# EAGLE design TLI5012B_E1000_2Go_Kit (EAGLE 9.5.2)

## Sheet 1 of 2
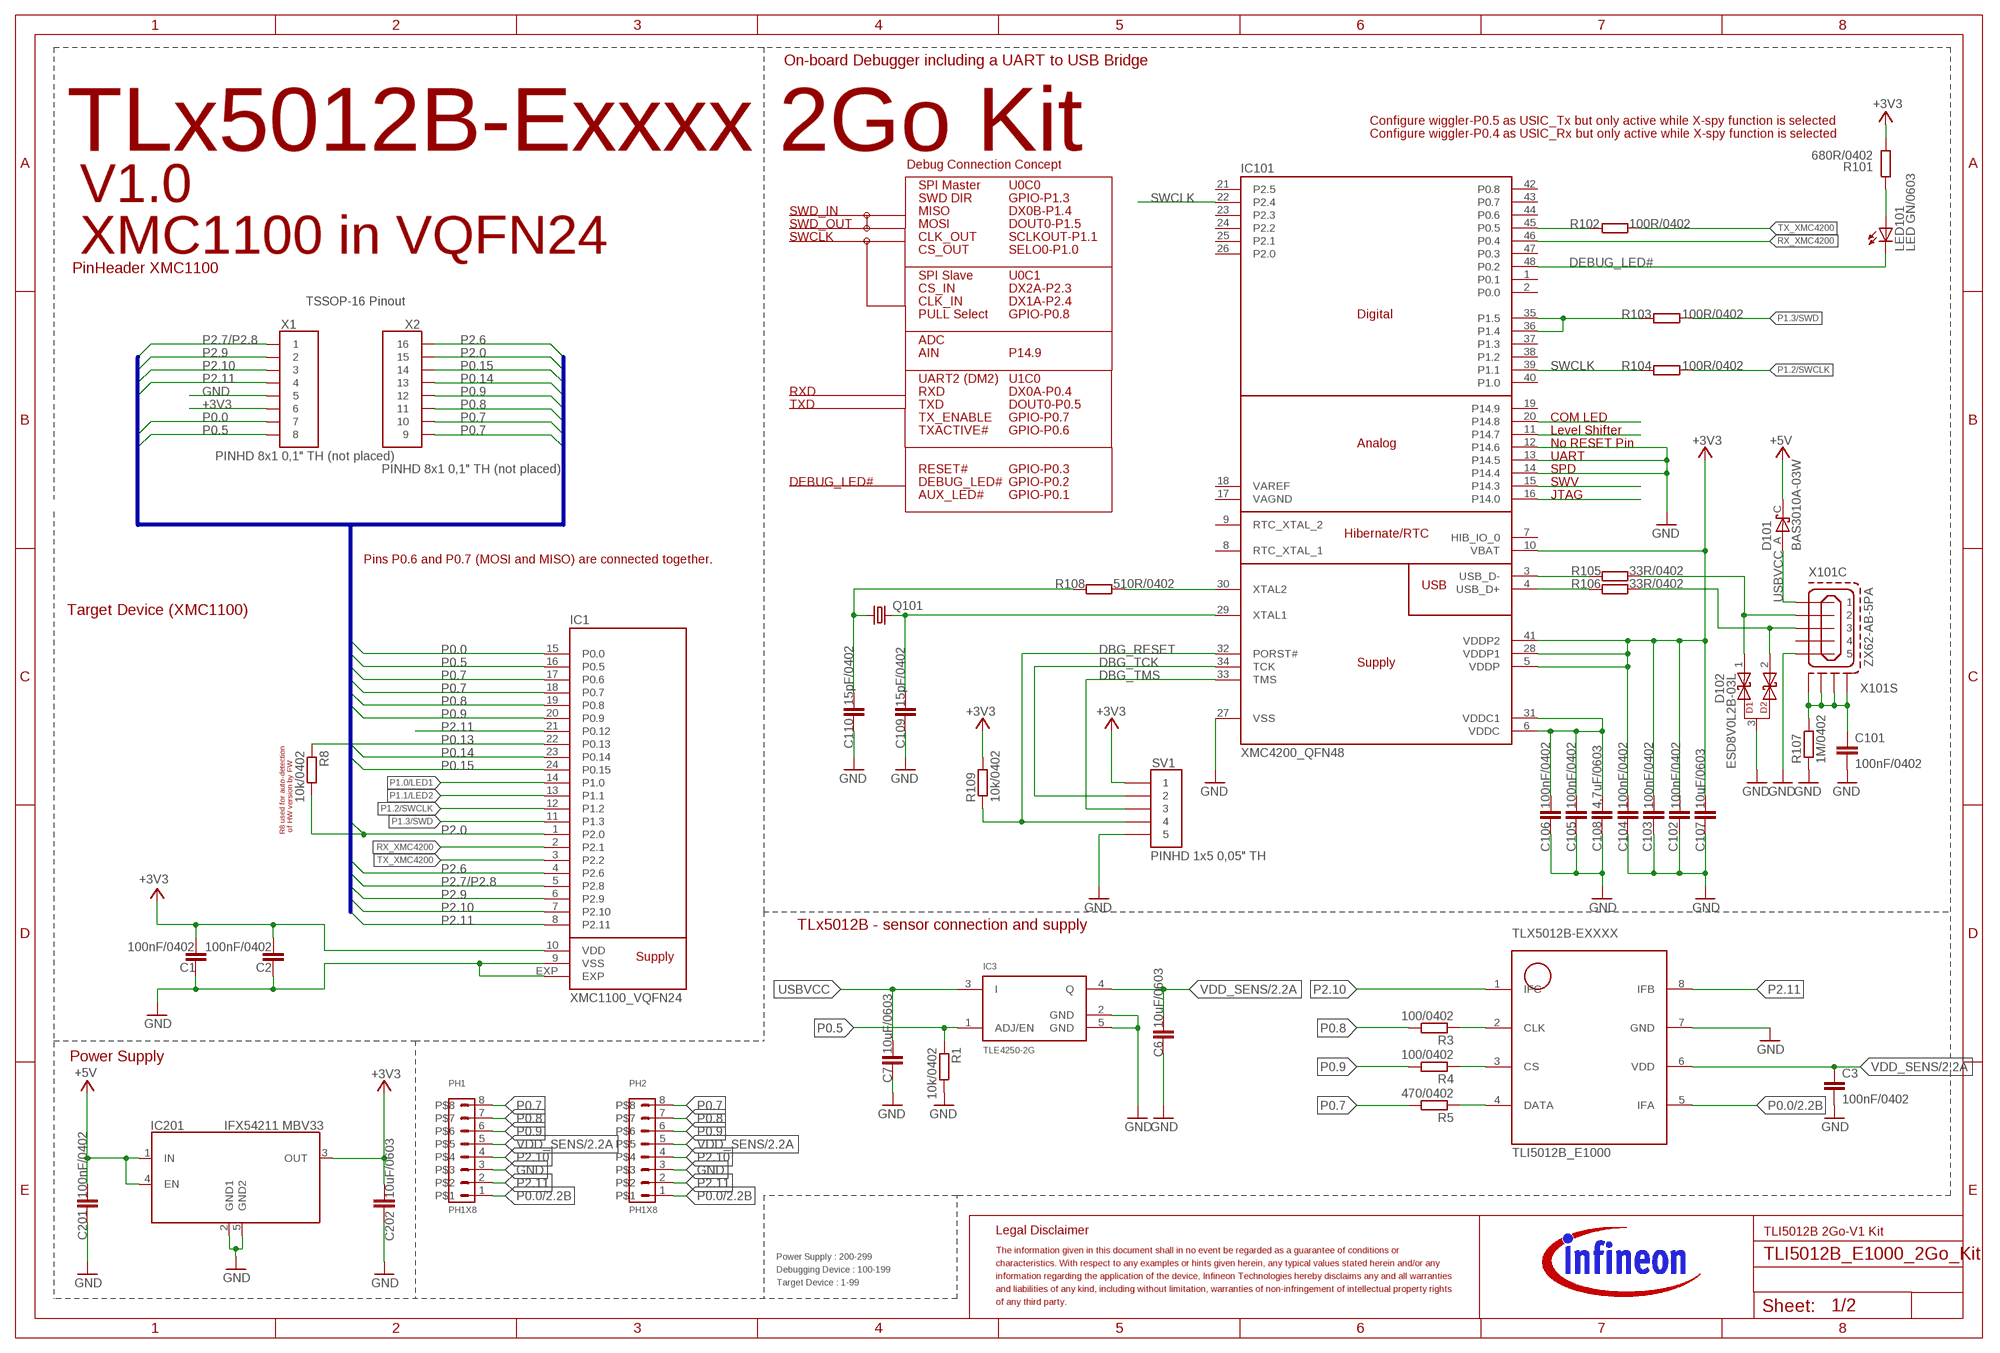
[diagram p0: schematic, sheet 1]

### Parts
C1  100nF/0402  C-EUC0402  [C0402]
C2  100nF/0402  C-EUC0402  [C0402]
C3  100nF/0402  C-EUC0402  [C0402]
C6  10uF/0603  C-EUC0603  [C0603]
C7  10uF/0603  C-EUC0603  [C0603]
C101  100nF/0402  C-EUC0402  [C0402]
C102  100nF/0402  C-EUC0402  [C0402]
C103  100nF/0402  C-EUC0402  [C0402]
C104  100nF/0402  C-EUC0402  [C0402]
C105  100nF/0402  C-EUC0402  [C0402]
C106  100nF/0402  C-EUC0402  [C0402]
C107  10uF/0603  C-EUC0603  [C0603]
C108  4,7uF/0603  C-EUC0603  [C0603]
C109  15pF/0402  C-EUC0402  [C0402]
C110  15pF/0402  C-EUC0402  [C0402]
C201  100nF/0402  C-EUC0402  [C0402]
C202  10uF/0603  C-EUC0603  [C0603]
D101  BAS3010A-03W  BAT60  [SOD323-R]
D102  ESD8V0L2B-03L  [TSLP-3-1]
IC1  XMC1100_VQFN24  [VQFN24]
IC3  TLE4250-2G  [PG-SCT595]
IC101  XMC4200_QFN48  [QFN-48-7X7]
IC201  IFX54211 MBV33  TLS202B1MBV  [SCT595_INFINEON]
LED101  LED GN/0603  LEDCHIPLED_0603  [CHIPLED_0603]
PH1  PH1X8  [PH005-1-8]
PH2  PH1X8  [PH005-1-8]
Q101  NX3225_2  [32X25_4PAD]
R1  10k/0402  R-EU_R0402  [R0402]
R3  100/0402  R-EU_R0402  [R0402]
R4  100/0402  R-EU_R0402  [R0402]
R5  470/0402  R-EU_R0402  [R0402]
R8  10k/0402  R-EU_R0402  [R0402]
R101  680R/0402  R-EU_R0402  [R0402]
R102  100R/0402  R-EU_R0402  [R0402]
R103  100R/0402  R-EU_R0402  [R0402]
R104  100R/0402  R-EU_R0402  [R0402]
R105  33R/0402  R-EU_R0402  [R0402]
R106  33R/0402  R-EU_R0402  [R0402]
R107  1M/0402  R-EU_R06030402  [R0402]
R108  510R/0402  R-EU_R0402  [R0402]
R109  10k/0402  R-EU_R0402  [R0402]
SV1  PINHD 1x5 0,05" TH  PINHEAD_127  [PINHEAD_127]
TLX5012B-EXXXX  TLI5012B_E1000  [INF-PG-DSO-8-16]
X1  PINHD 8x1 0,1" TH (not placed)  PINHD_1X8_SP  [PINHD_1X8_SP]
X2  PINHD 8x1 0,1" TH (not placed)  PINHD_1X8_SP  [PINHD_1X8_SP]
X101  ZX62-AB-5PA  ZX62-AB-5PA_MICRO-USB  [ZX62-AB-5PA_MICRO-USB]

### Nets
+3V3: C1.2 C2.2 C102.1 C103.1 C104.1 C107.1 C202.1 IC1.10(VDD) IC101.5(VDDP) IC101.10(VBAT) IC101.28(VDDP1) IC101.41(VDDP2) IC201.3(OUT) R101.1 R109.2 SV1.P$1 X1.6
+5V: C201.1 D101.C IC201.1(IN) IC201.4(EN)
DBG_RESET: IC101.32(PORST#) R109.1 SV1.P$4
DBG_TCK: IC101.34(TCK) SV1.P$2
DBG_TMS: IC101.33(TMS) SV1.P$3
DEBUG_LED#: IC101.48(P0.2) LED101.C
GND: C1.1 C2.1 C3.2 C6.2 C7.2 C101.2 C102.2 C103.2 C104.2 C105.2 C106.2 C107.2 C108.2 C109.2 C110.2 C201.2 C202.2 D102.3 IC1.9(VSS) IC1.EXP IC3.2(GND) IC3.5(GND) IC101.12(P14.6) IC101.13(P14.5) IC101.14(P14.4) IC101.27(VSS) IC201.2(GND1) IC201.5(GND2) PH1.3 PH2.3 R1.2 R107.1 SV1.P$5 TLX5012B-EXXXX.7(GND) X1.5 X101.5 ; also sheet 2
N$2: IC101.35(P1.5) IC101.36(P1.4) R103.1
N$4: R3.1 TLX5012B-EXXXX.2(CLK)
N$5: R4.1 TLX5012B-EXXXX.3(CS)
N$6: IC101.45(P0.5) R102.1
N$7: IC101.20(P14.8)
N$8: IC101.11(P14.7)
N$9: R5.1 TLX5012B-EXXXX.4(DATA)
N$20: IC101.16(P14.0)
N$21: IC101.15(P14.3)
N$23: C101.1 R107.2 X101.S1(S:S1) X101.S2(S:S2) X101.S3(S:S3) X101.S4(S:S4)
N$36: LED101.A R101.2
N$40: D102.1 R105.2 X101.2
N$41: D102.2 R106.2 X101.3
N$42: IC101.30(XTAL2) R108.2
N$43: C110.1 Q101.1 R108.1
P0.0: IC1.15(P0.0) PH1.1 PH2.1 TLX5012B-EXXXX.5(IFA) X1.7 ; also sheet 2
P0.5: IC1.16(P0.5) IC3.1(ADJ/EN) R1.1 X1.8
P0.7: IC1.17(P0.6) IC1.18(P0.7) PH1.8 PH2.8 R5.2 X2.7 X2.8
P0.8: IC1.19(P0.8) PH1.7 PH2.7 R3.2 X2.6
P0.9: IC1.20(P0.9) PH1.6 PH2.6 R4.2 X2.5
P0.13: IC1.22(P0.13) R8.1
P0.14: IC1.23(P0.14) X2.4 ; also sheet 2
P0.15: IC1.24(P0.15) X2.3 ; also sheet 2
P1.0/LED1: IC1.14(P1.0)
P1.1/LED2: IC1.13(P1.1)
P1.2/SWCLK: IC1.12(P1.2) R104.2
P1.3/SWD: IC1.11(P1.3) R103.2
P2.0: IC1.1(P2.0) R8.2 X2.2
P2.6: IC1.4(P2.6) X2.1
P2.7/P2.8: IC1.5(P2.8) X1.P$1
P2.9: IC1.6(P2.9) X1.2
P2.10: IC1.7(P2.10) PH1.4 PH2.4 TLX5012B-EXXXX.1(IFC) X1.3
P2.11: IC1.8(P2.11) IC1.21(P0.12) PH1.2 PH2.2 TLX5012B-EXXXX.8(IFB) X1.4
Q200: C109.1 IC101.29(XTAL1) Q101.3
RX_XMC4200: IC1.2(P2.1) IC101.46(P0.4)
SWCLK: IC101.22(P2.4) IC101.39(P1.1) R104.1
TX_XMC4200: IC1.3(P2.2) R102.2
USBVCC [usbvcc]: C7.1 D101.A IC3.3(I) X101.1
VDD_SENS: C3.1 C6.1 IC3.4(Q) PH1.5 PH2.5 TLX5012B-EXXXX.6(VDD) ; also sheet 2
WUSB_DM: IC101.3(USB_D-) R105.1
WUSB_DP: IC101.4(USB_D+) R106.1
WVDDC: C105.1 C106.1 C108.1 IC101.6(VDDC) IC101.31(VDDC1)
Unconnected: IC101.1(P0.1) IC101.2(P0.0) IC101.7(HIB_IO_0) IC101.8(RTC_XTAL_1) IC101.9(RTC_XTAL_2) IC101.17(VAGND) IC101.18(VAREF) IC101.19(P14.9) IC101.21(P2.5) IC101.23(P2.3) IC101.24(P2.2) IC101.25(P2.1) IC101.26(P2.0) IC101.37(P1.3) IC101.38(P1.2) IC101.40(P1.0) IC101.42(P0.8) IC101.43(P0.7) IC101.44(P0.6) IC101.47(P0.3) X101.4

### Buses
P2.6,P2.0,P0.15,P0.14,P0.9,P0.8,P0.7,P0.6,P0.5,P0.0,P2.11,P2.10,P2.9,P2.7/P2.8

### Notes on the sheet
- On-board Debugger including a UART to USB Bridge
- Configure wiggler-P0.5 as USIC_Tx but only active while X-spy function is selected
- Configure wiggler-P0.4 as USIC_Rx but only active while X-spy function is selected
- TLx5012B-Exxxx 2Go Kit
- Debug Connection Concept
- SPI Master | U0C0
- V1.0 | SWD DIR | GPIO-P1.3
- SWD_IN | MISO | DX0B-P1.4
- SWD_OUT | MOSI | DOUT0-P1.5
- SWCLK | CLK_OUT | SCLKOUT-P1.1
- XMC1100 in VQFN24 | CS_OUT | SELO0-P1.0
- PinHeader XMC1100
- SPI Slave | U0C1
- CS_IN | DX2A-P2.3
- TSSOP-16 Pinout | CLK_IN | DX1A-P2.4
- PULL Select | GPIO-P0.8
- ADC
- 1 | 16
- AIN | P14.9
- 2 | 15
- 3 | 14
- UART2 (DM2) | U1C0
- 4 | 13
- RXD | RXD | DX0A-P0.4
- 5 | 12
- TXD | TXD | DOUT0-P0.5
- 6 | 11
- TX_ENABLE | GPIO-P0.7 | COM LED
- 7 | 10
- TXACTIVE# | GPIO-P0.6 | Level Shifter
- 8 | 9
- No RESET Pin
- UART
- RESET# | GPIO-P0.3 | SPD
- DEBUG_LED# | DEBUG_LED# | GPIO-P0.2 | SWV
- AUX_LED# | GPIO-P0.1 | JTAG
- Pins P0.6 and P0.7 (MOSI and MISO) are connected together.
- Target Device (XMC1100)
- R8 used for auto-detection
   of HW version by FW
- TLx5012B - sensor connection and supply
- Power Supply
- TLI5012B 2Go-V1 Kit
- Power Supply : 200-299
- Debugging Device : 100-199
- Target Device : 1-99

## Sheet 2 of 2
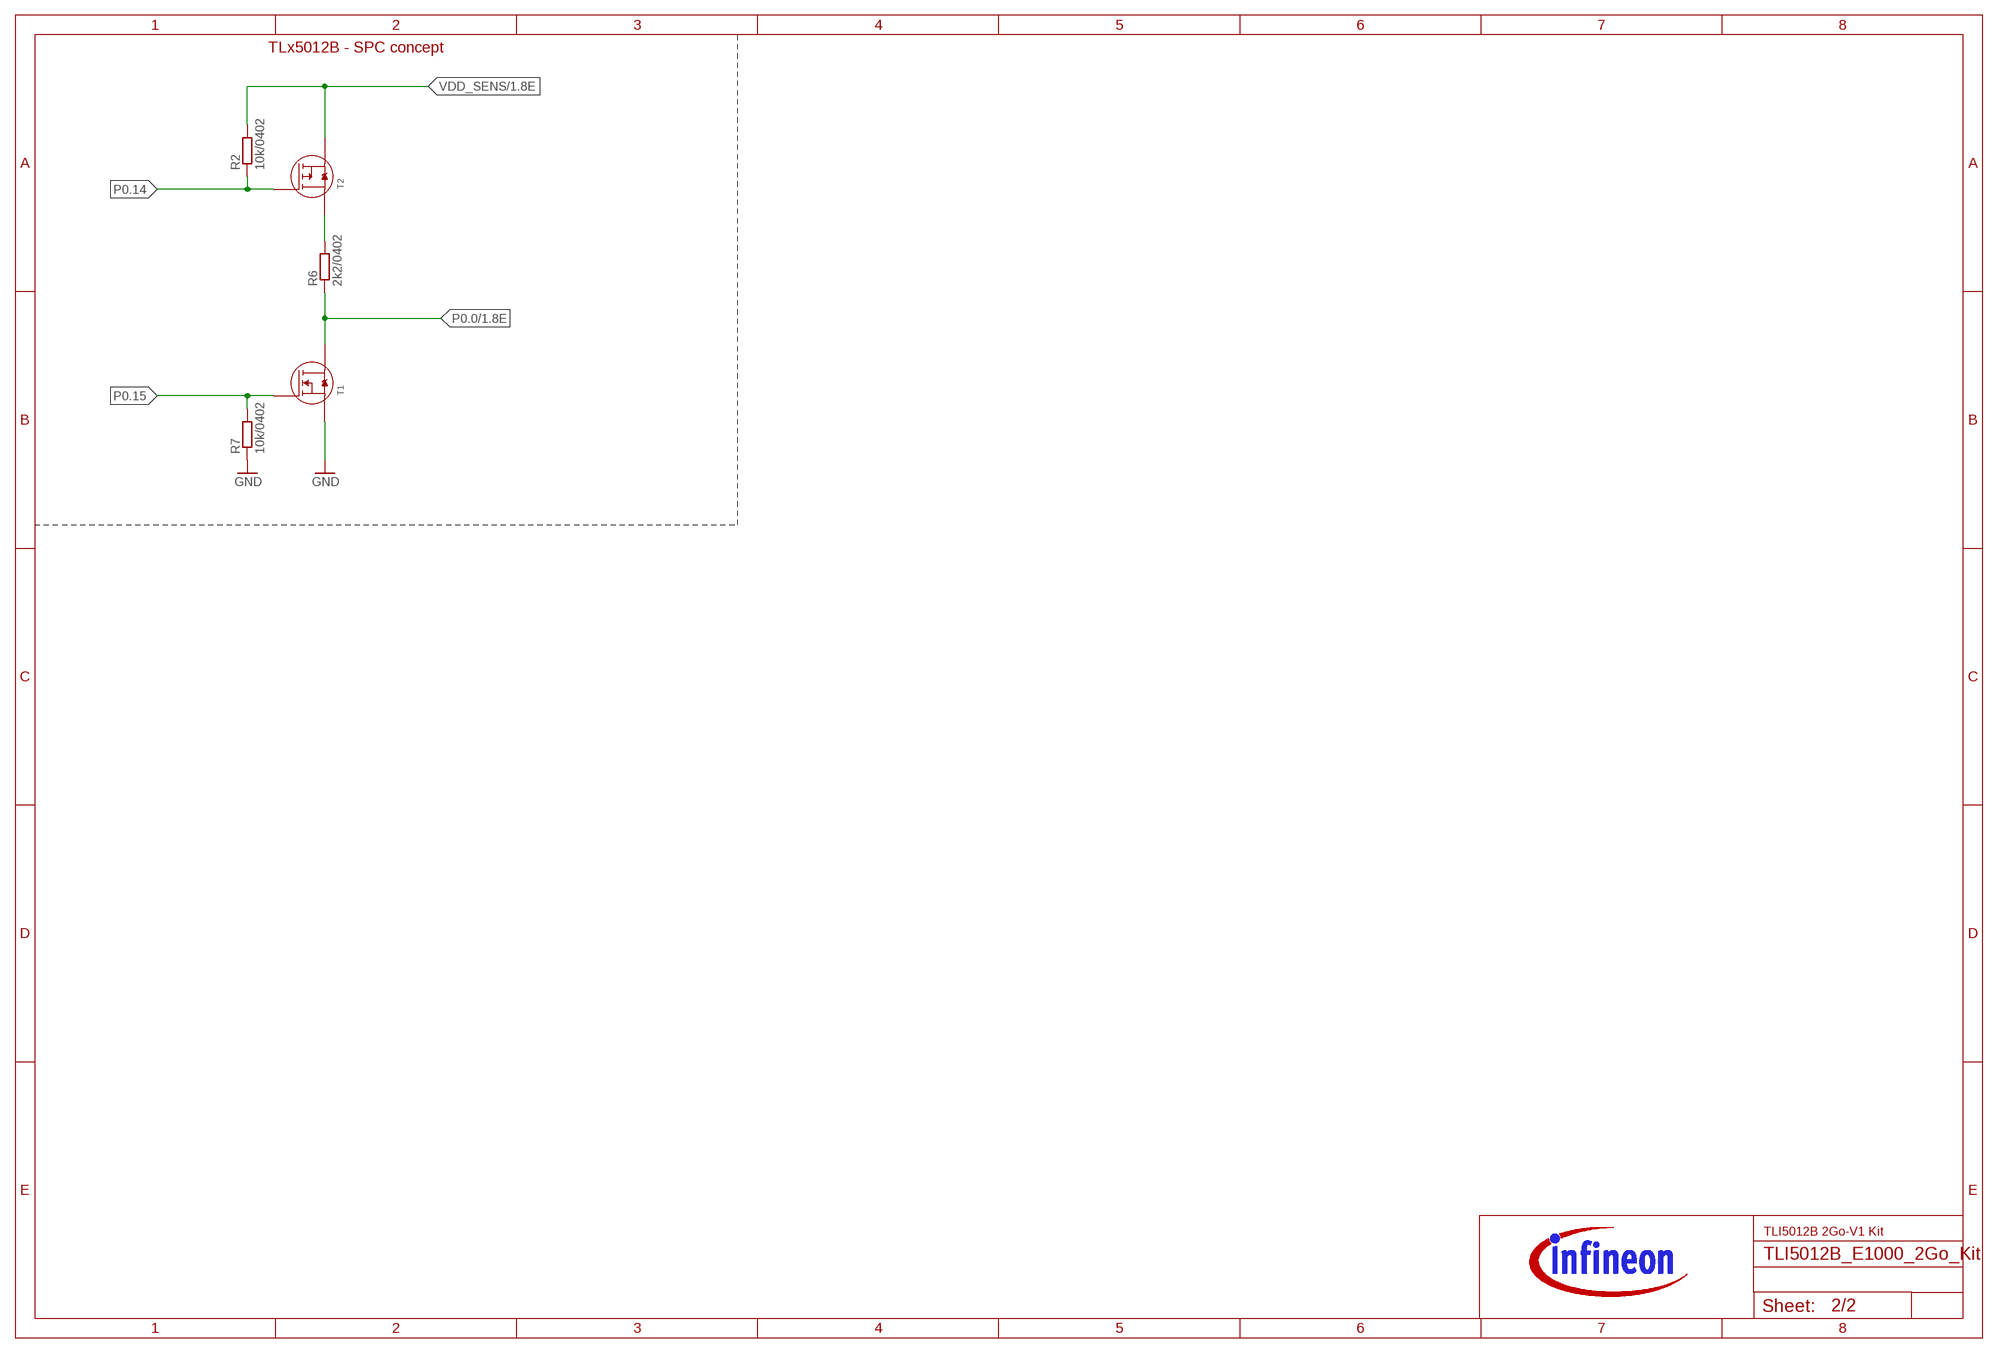
[diagram p1: schematic, sheet 2]

### Parts
R2  10k/0402  R-EU_R0402  [R0402]
R6  2k2/0402  R-EU_R0402  [R0402]
R7  10k/0402  R-EU_R0402  [R0402]
T1  BSS138N  [INF-PG-SOT23_N_1PRIMARY]
T2  BSS84P  [INF-PG-SOT23_N_1PRIMARY]

### Nets
GND: R7.1 T1.2(S) ; also sheet 1
N$1: R6.2 T2.3(D)
P0.0: R6.1 T1.3(D) ; also sheet 1
P0.14: R2.1 T2.1(G) ; also sheet 1
P0.15: R7.2 T1.1(G) ; also sheet 1
VDD_SENS: R2.2 T2.2(S) ; also sheet 1

### Notes on the sheet
- TLx5012B - SPC concept
- TLI5012B 2Go-V1 Kit

## Library data of the parts
C1-C3 C101-C106 C109 C110 C201 = DsC:C-EUC0402
C6 C7 C107 C108 C202 = rcl:C-EU: CAPACITOR, European symbol
D101 = DsDiod:BAT60
D102 = DsDiod:ESD8V0L2B-03L
IC1 = XMC1100:XMC1100_VQFN24
IC3 = TLE4250-2G:TLE4250-2G: TLE4250-2G Low Dropout Voltage Tracking Regulator PG-SCT595
IC101 = XMC4000_v4.16:XMC4200_QFN48
IC201 = TLS202B1:TLS202B1MBV
LED101 = led:LED: LED OSRAM: - CHIPLED LG R971, LG N971, LY N971, LG Q971, LY Q971, LO R971, LY R971 LH N974, LH R974 LS Q976, LO Q976, LY Q976 LO Q996 - Hyper CHIPLED LW Q18S LB Q993, LB Q99A, LB R99A - SideLED LS A670, LO A670, LY A670, LG A670, LP A670 LB A673, LV A673, LT A673, LW A673 LH A674 LY A675 LS A676, LA A676, LO A676, LY A676, LW A676 LS A679, LY A679, LG A679 - Hyper Micro SIDELED® LS Y876, LA Y876, LO Y876, LY Y876 LT Y87S - SmartLED LW L88C, LW L88S LB L89C, LB L89S, LG L890 LS L89K, LO L89K, LY L89K LS L896, LA L896, LO L896, LY L896 - TOPLED LS T670, LO T670, LY T670, LG T670, LP T670 LSG T670, LSP T670, LSY T670, LOP T670, LYG T670 LG T671, LOG T671, LSG T671 LB T673, LV T673, LT T673, LW T673 LH T674 LS T676, LA T676, LO T676, LY T676, LB T676, LH T676, LSB T676, LW T676 LB T67C, LV T67C, LT T67C, LS T67K, LO T67K, LY T67K, LW E67C LS E67B, LA E67B, LO E67B, LY E67B, LB E67C, LV E67C, LT E67C LW T67C LS T679, LY T679, LG T679 LS T770, LO T770, LY T770, LG T770, LP T770 LB T773, LV T773, LT T773, LW T773 LH T774 LS E675, LA E675, LY E675, LS T675 LS T776, LA T776, LO T776, LY T776, LB T776 LHGB T686 LT T68C, LB T68C - Hyper Mini TOPLED® LB M676 - Mini TOPLED Santana® LG M470 LS M47K, LO M47K, LY M47K Source: http://www.osram.convergy.de LUXEON: - LUMILED® LXK2-PW12-R00, LXK2-PW12-S00, LXK2-PW14-U00, LXK2-PW14-V00 LXK2-PM12-R00, LXK2-PM12-S00, LXK2-PM14-U00 LXK2-PE12-Q00, LXK2-PE12-R00, LXK2-PE12-S00, LXK2-PE14-T00, LXK2-PE14-U00 LXK2-PB12-K00, LXK2-PB12-L00, LXK2-PB12-M00, LXK2-PB14-N00, LXK2-PB14-P00, LXK2-PB14-Q00 LXK2-PR12-L00, LXK2-PR12-M00, LXK2-PR14-Q00, LXK2-PR14-R00 LXK2-PD12-Q00, LXK2-PD12-R00, LXK2-PD12-S00 LXK2-PH12-R00, LXK2-PH12-S00 LXK2-PL12-P00, LXK2-PL12-Q00, LXK2-PL12-R00 Source: www.luxeon.com KINGBRIGHT: KA-3528ASYC Source: www.kingbright.com
PH1 PH2 = nonstandardpinhead:PH1X8
Q101 = Quarz:NX3225_2
R1-R8 R101-R106 R108 R109 = DsR:R-EU_R0402
R107 = DsR:R-EU_R0603
SV1 = pinhead_127_marked:PINHEAD_127
T1 = INF-PG-SOT23_N:BSS138N
T2 = INF-PG-SOT23_N:BSS84P
TLX5012B-EXXXX = TLI5012B_E1000:TLI5012B_E1000
X1 = Pinhead_1x8_sp_V2:PINHD_1X8_SP
X2 = Pinhead_1x8_sp:PINHD_1X8_SP
X101 = XSRRND:ZX62-AB-5PA_MICRO-USB

## Net classes
0 default: width 0.178 mm, drill 0.127 mm, clearance 0.2 mm
1 power: width 0.61 mm, drill 0.127 mm, clearance 0.152 mm
2 gnd: width 0.305 mm, drill 0.127 mm, clearance 0.152 mm
3 usbvcc: width 0.508 mm, drill 0.127 mm, clearance 0.152 mm
4 aref: width 0.406 mm

## Board
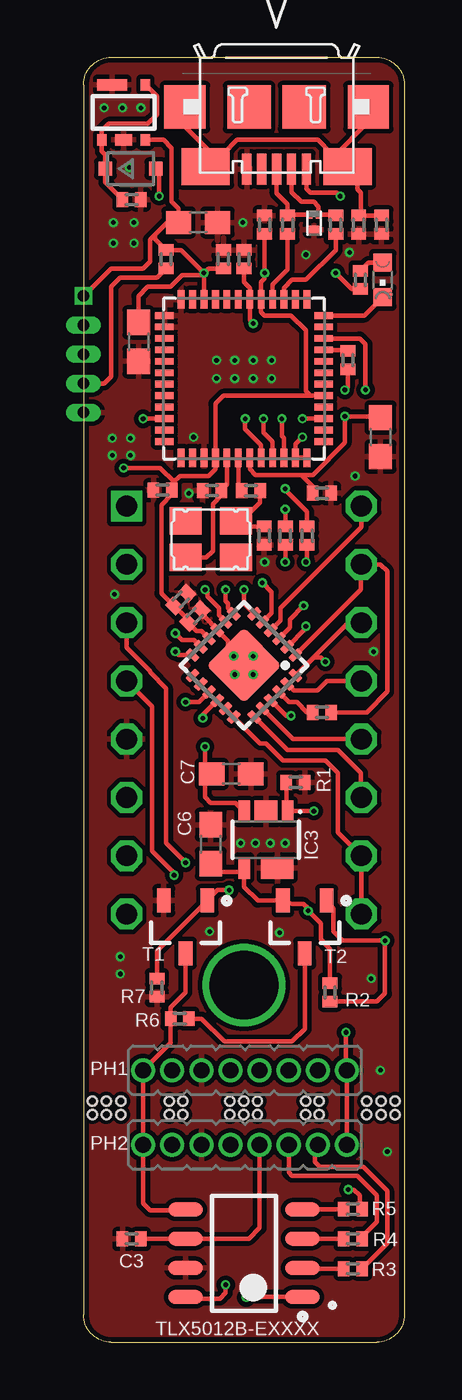
[diagram p2: board, top side]
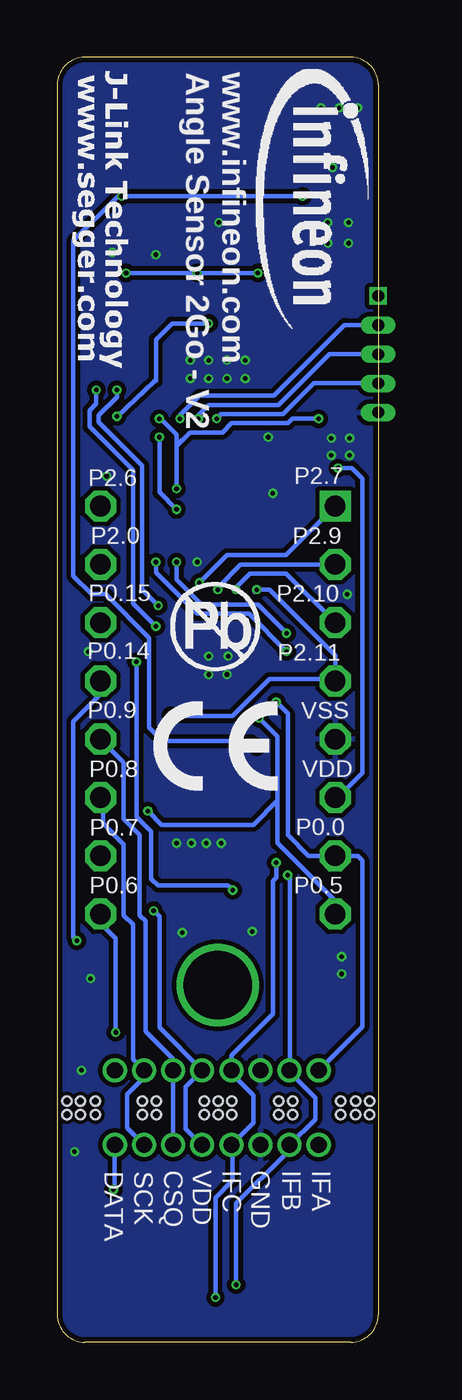
[diagram p3: board, bottom side, seen from below]

Size 14 x 56 mm. Coordinates in mm from the lower left corner, seen from the top.
Outline: 0,54.8 arc-90 1.2,56 12.8,56 arc-90 14,54.8 14,1.2 arc-90 12.8,0 1.2,0 arc-90 0,1.2 0,54.8
Copper layers (1*16): Top 0.018mm / dielectric 1.55mm / Bottom 0.018mm
Design rules "Multi-CB_2L_100um-Tracks_OL35um *": minimum track width 0.1mm, minimum drill 0.1mm, track to track 0.1mm, track to pad 0.1mm, pad to pad 0.1mm, via to via 0.1mm, smd to smd 0mil, copper to edge 0.2mm, drill to drill 0.2mm, minimum pad ring 0.1mm, minimum via ring 0.1mm, stop-mask expansion 2mil, vias tented up to drill 0.45mm, thermal gap 0.2mm
Holes 0.4 mm at 6.99,10.51 7.59,10.51 7.59,9.91 6.99,9.91 9.69,10.51 9.69,9.91 10.29,9.91 10.29,10.51 12.99,10.51 13.59,10.51 12.99,9.91 13.59,9.91 4.34,10.51 0.99,10.51 0.39,10.51 4.34,9.91 0.99,9.91 0.39,9.91 6.39,10.51 6.39,9.91 1.64,10.51 1.64,9.91 3.74,10.51 3.74,9.91 12.34,10.51 12.34,9.91
tRestrict: 4 lines

### Footprints (pad centres in the part's own frame; a part is rotated, then mirrored left to right if it is on the bottom)
C0402 = smd 0.5 x 0.65: 1 -0.4,0; 2 0.4,0
C0603 = smd 1.1 x 1: 1 -0.85,0; 2 0.85,0
SOD323-R = smd 0.6 x 0.6: A 1.1,0; C -1.1,0
TSLP-3-1 = smd 0.225 x 0.35: 1 0.113,-0.475; 2 0.487,-0.475 | smd 0.6 x 0.35: 3 0.3,0.175
VQFN24 = smd 0.6 x 0.3: 1 -1.905,1.27; 2 -1.905,0.762; 3 -1.905,0.254; 4 -1.905,-0.254; 5 -1.905,-0.762; 6 -1.905,-1.27; 13 1.905,-1.27; 14 1.905,-0.762; 15 1.905,-0.254; 16 1.905,0.254; 17 1.905,0.762; 18 1.905,1.27 | smd 0.3 x 0.6: 7 -1.27,-1.905; 8 -0.762,-1.905; 9 -0.254,-1.905; 10 0.254,-1.905; 11 0.762,-1.905; 12 1.27,-1.905; 19 1.27,1.905; 20 0.762,1.905; 21 0.254,1.905; 22 -0.254,1.905; 23 -0.762,1.905; 24 -1.27,1.905 | smd 2.35 x 2.35: EXP 0,0
PG-SCT595 = smd 0.95 x 0.5: 1 -1.225,0.95; 3 -1.225,-0.95; 4 1.225,-0.95 | smd 0.95 x 1: 2 -1.225,0 | smd 0.95 x 1.4: 5 1.225,0.5
QFN-48-7X7 = smd 0.8 x 0.3: 1 -3.45,2.75; 2 -3.45,2.25; 3 -3.45,1.75; 4 -3.45,1.25; 5 -3.45,0.75; 6 -3.45,0.25; 7 -3.45,-0.25; 8 -3.45,-0.75; 9 -3.45,-1.25; 10 -3.45,-1.75; 11 -3.45,-2.25; 12 -3.45,-2.75; 25 3.45,-2.75; 26 3.45,-2.25; 27 3.45,-1.75; 28 3.45,-1.25; 29 3.45,-0.75; 30 3.45,-0.25; 31 3.45,0.25; 32 3.45,0.75; 33 3.45,1.25; 34 3.45,1.75; 35 3.45,2.25; 36 3.45,2.75 | smd 0.3 x 0.8: 13 -2.75,-3.475; 14 -2.25,-3.475; 15 -1.75,-3.475; 16 -1.25,-3.475; 17 -0.75,-3.475; 18 -0.25,-3.475; 19 0.25,-3.475; 20 0.75,-3.475; 21 1.25,-3.475; 22 1.75,-3.475; 23 2.25,-3.475; 24 2.75,-3.475; 37 2.75,3.475; 38 2.25,3.475; 39 1.75,3.475; 40 1.25,3.475; 41 0.75,3.475; 42 0.25,3.475; 43 -0.25,3.475; 44 -0.75,3.475; 45 -1.25,3.475; 46 -1.75,3.475; 47 -2.25,3.475; 48 -2.75,3.475
SCT595_INFINEON = smd 0.4 x 0.5: 1 -0.95,-1.2; 3 0.95,-1.2; 4 0.95,1.2 | smd 0.75 x 0.5: 2 0,-1.2 | smd 1.3 x 0.5: 5 -0.5,1.2
CHIPLED_0603 = smd 0.8 x 0.8: A 0,-0.75; C 0,0.75
PH005-1-8 = drill 0.7 pad 1.016: 1 0,0; 2 1.27,0; 3 2.54,0; 4 3.81,0; 5 5.08,0; 6 6.35,0; 7 7.62,0; 8 8.89,0
32X25_4PAD = smd 1.4 x 1.2: 1 -1.1,-0.8; 2 1.1,-0.8; 3 1.1,0.8; 4 -1.1,0.8
R0402 = smd 0.5 x 0.65: 1 -0.4,0; 2 0.4,0
PINHEAD_127 = drill 0.508 square: P$1 0,0 | drill 0.508 long: P$2 0,-1.27; P$3 0,-2.54; P$4 0,-3.81; P$5 0,-5.08
INF-PG-SOT23_N_1PRIMARY = smd 1.05 x 0.6: 1 -1.15,0.95; 2 -1.15,-0.95; 3 1.15,0
INF-PG-DSO-8-16 = smd 1.5 x 0.6: 1 -2.55,1.905; 2 -2.55,0.635; 3 -2.55,-0.635; 4 -2.55,-1.905; 5 2.55,-1.905; 6 2.55,-0.635; 7 2.55,0.635; 8 2.55,1.905
PINHD_1X8_SP = drill 0.9 octagon: 2 0,7.62; 3 0,5.08; 4 0,2.54; 5 0,0; 6 0,-2.54; 7 0,-5.08; 8 0,-7.62 | drill 0.9 square: P$1 0,10.16
PINHD_1X8_SP' = drill 0.9 octagon: 1 0,10.16; 2 0,7.62; 3 0,5.08; 4 0,2.54; 5 0,0; 6 0,-2.54; 7 0,-5.08; 8 0,-7.62
ZX62-AB-5PA_MICRO-USB = smd 0.4 x 1.35: 1 -1.3,1.45; 2 -0.65,1.45; 3 0,1.45; 4 0.65,1.45; 5 1.3,1.45 | smd 2.1 x 1.6: S1 -3.1,1.35; S2 3.1,1.35 | smd 1.8 x 1.9: S3 -4,-1.25; S4 4,-1.25 | smd 1.9 x 1.9: S5 -1.2,-1.25; S6 1.2,-1.25

### Placement (x,y rotation side)
C1  4.85,31.65 225 top
C2  4.24,32.37 225 top
C3  2.1,4.5 180 top
C6  5.55,21.7 90 top
C7  6.45,24.77 0 top
C101  13,48.7 270 top
C102  3.45,37.14 180 top
C103  6.1,47.2 90 top
C104  7.9,48.7 90 top
C105  10.4,37 0 top
C106  7,47.2 90 top
C107  2.4,43.6 270 top
C108  12.95,39.45 270 top
C109  5.6,37.12 180 top
C110  7.88,35.15 270 top
C201  2.1,49.8 0 top
C202  5,48.8 0 top
D101  2.05,51.15 0 top
D102  10.36,48.67 180 top
IC1  7,29.5 225 top
IC3  7.95,21.9 270 top
IC101  7,42 270 top
IC201  1.75,53.6 0 top
LED101  13.05,46.3 180 top
PH1  2.6,11.85 0 top
PH2  2.6,8.6 0 top
Q101  5.55,35 180 top
R1  9.25,24.4 0 top
R2  10.75,15.25 90 top
R3  11.75,3.2 0 top
R4  11.75,4.5 0 top
R5  11.75,5.8 0 top
R6  4.2,14.1 0 top
R7  3.2,15.45 90 top
R8  10.4,27.45 0 top
R101  12.08,46.3 90 top
R102  11.53,42.8 270 top
R103  8.8,35.15 270 top
R104  9.75,35.15 270 top
R105  11,48.7 90 top
R106  8.9,48.7 90 top
R107  12,48.7 90 top
R108  7.3,37.11 180 top
R109  3.6,47.2 90 top
SV1  0,45.6 0 top
T1  4.45,18.1 270 top
T2  9.65,18.1 270 top
TLX5012B-EXXXX  7,3.88 180 top
U$2  [INFINEON_LOGO_INFINEON_LOGO_5_SILK]  5.74,55.89 270 bottom
U$3  [CE_KENNEZCIHNUNG]  6.91,26.22 180 bottom
X1  1.88,26.28 0 top
X2  PINHD 8x1 0,1" TH (not placed)  [PINHD_1X8_SP']  12.12,26.28 0 top
X101  8.42,52.58 180 top

### Tracks (layer width: path | path; a pad name or v marks a point on that pad's centre or on a via)
+3V3  (via drill 0.2)
  Top 0.2: IC201.3 3.5,52.4 3.85,52.05 3.85,49.7 4.15,49.4 C202.1 | SV1.P$1 1.2,46.8 2.6,46.8 2.9,47.1 2.9,48.05 3.12,48.27 | 3.12,48.27 3.65,48.8 C202.1 | 3.12,48.27 3.12,48.08 R109.2 4.25,47.6 v5.25,46.6 | C104.1 v7.9,46.6 7.9,46.35 7.75,46.2 IC101.5 7.75,44.9 7.9,44.75 9.05,44.75 9.7,44.1 9.7,41.45 9.9,41.25 IC101.41 6.1,41.25 5.75,40.9 IC101.28 5.75,38.05 5.45,37.75 4.2,37.75 3.95,37.5 | v5.25,46.6 IC101.10 | C202.1 4.3,48.8 | C103.1 5.45,46.8 v5.25,46.6 | C1.2 4.62,31.32 | C1.2 4.47,31.37 4.47,31.58 C2.2 3.89,32.14 3.4,32.63 3.4,36.49 3.85,36.94 C102.1 | IC1.10 5.15,31 4.93,31 C1.2 | C107.1 2.4,45.6 2.8,46 3.8,46 4.3,46.5 5.15,46.5 v5.25,46.6 | C102.1 3.8,36.94 | R101.1 11.7,45.9 v11,46.6 | 3.95,37.5 3.85,37.4 C102.1 | 3.95,37.5 3.35,38.1 v1.75,38.1
  Bottom 0.2: v5.25,46.6 v7.9,46.6 v11,46.6 | X1.6 1.76,23.74 0.7,24.8 0.7,37.65 1.15,38.1 v1.75,38.1
+5V
  Top 0.2: C201.1 0.95,50.55 D101.C 0.95,51.75 0.8,51.9 IC201.1 0.8,52.8 1.1,53.1 2.8,53.1 3.2,53.5 3.2,54.3 IC201.4
DBG_RESET  (via drill 0.2)
  Top 0.2: R109.1 3.2,46.4 1.6,46.4 1.2,46 1.2,42.09 0.9,41.79 SV1.P$4 0.64,41.79 | IC101.32 7.75,39.1 7.05,39.8 v7.05,40.25
  Bottom 0.2: SV1.P$4 2.8,41.8 4.15,40.45 6.85,40.45 v7.05,40.25
DBG_TCK  (via drill 0.2)
  Top 0.2: IC101.34 8.75,39.4 8.65,39.5 v8.65,40.25
  Bottom 0.2: SV1.P$2 1.47,44.33 4.55,41.25 7.8,41.25 8.65,40.4 v8.65,40.25
DBG_TMS  (via drill 0.2)
  Top 0.2: IC101.33 8.25,39.25 7.85,39.65 v7.85,40.25
  Bottom 0.2: SV1.P$3 2.14,43.06 4.35,40.85 7.4,40.85 7.85,40.4 v7.85,40.25
DEBUG_LED#
  Top 0.2: LED101.C 12.25,44.75 IC101.48
GND  (via drill 0.2)
  Top 0.2: v6.55,29.9 6.3,30.15 6.3,30.55 5.83,31.02 IC1.9 5.83,31.07 5.3,31.6
  other vias: 9.7,47.4 6.6,42 7.4,42 6.6,42.8 7.4,42.8 8.2,42.8 8.2,42 6.95,48.8 11.6,47.5 5.8,42.8 5.8,42 1.3,48.8 2.2,48.8 2.2,47.9 1.3,47.9 1.25,39.4 2.05,39.4 2.05,38.65 1.25,38.65 11.85,37.75 4.6,37 0.9,53.8 1.7,53.8 2.5,53.8 7.4,29.1 7.4,29.9 6.6,29.1 4.8,39.45 7.9,34 2,51.2 1.35,32.6 13.25,8.3 12.95,11.85 8.8,21.75 12.55,15.85 6.85,21.75 7.5,21.75 8.15,21.75 5.5,17.9 8.55,17.85 1.6,16.05 1.6,16.8 12.65,30.1
  pour Top (isolate 0.2): 0,0 0,56 14,56 14,0
  pour Bottom: 0,56 14,56 14,0 0,0
N$1
  Top 0.2: R6.2 5.15,14.1 6.15,13.1 9.1,13.1 9.65,13.65 T2.3 9.85,16.6
N$2  (via drill 0.2)
  Top 0.2: v8.8,36.3 R103.1 | v9.55,39.45 9.25,39.15 IC101.35 IC101.36
  Bottom 0.2: v8.8,36.3 9.55,37.05 v9.55,39.45
N$4
  Top 0.2: R3.1 9.59,3.2 TLX5012B-EXXXX.2
N$5
  Top 0.2: R4.1 TLX5012B-EXXXX.3
N$6
  Top 0.2: R102.1 11.48,43.25 IC101.45
N$9
  Top 0.2: R5.1 9.57,5.8 TLX5012B-EXXXX.4
N$10  (via drill 3)
  other vias: 7,15.56
N$23
  Top 0.2: C101.1 R107.2 12.1,49.2 | 11.87,50.75 X101.S1 | X101.S2 5.22,50.92 6.1,51.8 | 10.82,51.8 11.87,50.75 | 12.1,49.2 12.2,49.2 | 6.1,51.8 5.6,51.8 4.32,53.08 X101.S4 | 10.82,51.8 11.04,51.8 12.32,53.08 X101.S3 | 11.87,50.75 11.95,50.75 11.95,50.25 12.1,50.1 12.1,49.2 | 6.1,51.8 6.7,52.4 10.22,52.4 10.82,51.8
N$36
  Top 0.2: R101.2 12.43,47.05 LED101.A
N$40
  Top 0.2: 10.9,49.2 R105.2 10.95,49.25 10.85,49.14 D102.1 10.25,49.25 10.25,49.5 10.05,49.7 9.5,49.7 9.07,50.13 X101.2
N$41
  Top 0.2: D102.2 8.95,49.14 R106.2 8.9,49.6 8.42,50.08 X101.3
N$42
  Top 0.2: IC101.30 6.75,37.26 R108.2
N$43
  Top 0.2: 6.82,35.45 Q101.1 6.95,35.85 | R108.1 7.7,36.6 6.95,35.85 | C110.1 7.25,35.55 6.95,35.85
P0.0  (via drill 0.2)
  Top 0.2: v4.45,27.9 5.04,27.9 IC1.15 | TLX5012B-EXXXX.5 4.42,5.75 2.9,5.75 2.6,6.05 PH2.1 PH1.1 3.8,13.05 R6.1 3.8,14.6 4.45,15.25 T1.3
  Bottom 0.2: v4.45,27.9 3.95,27.4 3.95,22.1 3.05,21.2 X1.7 0.9,21.2 0.7,21 0.7,13.75 PH1.1
P0.5  (via drill 0.2)
  Top 0.2: v5.2,27.2 5.2,27.34 IC1.16 | R1.1 8.85,23.02 IC3.1 9.07,23.15 v10.05,23.15
  Bottom 0.2: X1.8 1.88,19.23 4.4,21.75 4.4,23.6 | v5.2,27.2 4.4,26.4 4.4,23.6 | 4.4,23.6 5.45,22.55 9.45,22.55 v10.05,23.15
P0.7  (via drill 0.2)
  Top 0.2: IC1.17 IC1.18 | X2.8 X2.7 11.1,22.22 11.1,24.8 10.55,25.35 8.7,25.35 7.95,26.1 7.71,26.1 IC1.18 | IC1.18 6.55,27.2 | PH2.8 PH1.8 11.45,11.89 v11.45,13.5 | v11.55,6.65 11.8,6.65 12.05,6.4 12.05,5.9 R5.2
  Bottom 0.2: X2.8 12.15,18.63 12.15,18.3 11.45,17.6 v11.45,13.5 | PH2.8 11.49,6.71 v11.55,6.65
P0.8
  Top 0.2: IC1.19 8.9,25.8 11.1,25.8 12.1,24.8 12.1,23.76 X2.6 | R3.2 13.25,4.3 13.25,6.6 12.2,7.65 10.3,7.65 10.1,7.85 10.1,8.48 PH2.7
  Bottom 0.2: X2.6 12.01,23.62 12,23.62 12,22.6 11.1,21.7 11.1,18.6 10.7,18.2 10.7,12.33 PH1.7 10.22,11.83 10.25,11.8 10.25,11.5 10.95,10.8 10.95,9.33 PH2.7
P0.9
  Top 0.2: X2.5 9.14,26.28 IC1.20 | R4.2 12.15,4.6 12.8,5.25 12.8,6.4 11.95,7.25 9.1,7.25 8.95,7.4 PH2.6
  Bottom 0.178: 12,26.25 X2.5
  Bottom 0.2: X2.5 11.15,25.31 11.15,25.3 11.1,25.25 11.1,22.8 10.4,22.1 10.4,18.6 10.15,18.35 10.15,13.55 8.95,12.35 PH1.6 PH2.6
P0.13
  Top 0.2: R8.1 9.75,27.45 9.3,27.9 8.96,27.9 IC1.22
P0.14  (via drill 0.2)
  Top 0.2: IC1.23 9.18,28.4 10.2,28.4 10.62,28.82 X2.4 | T2.1 10.9,18.9 10.9,17.9 11.3,17.5 v13.15,17.5 13.15,15.2 12.8,14.85 R2.1
  Bottom 0.2: v13.15,17.5 13.3,17.65 13.3,27.05 12.15,28.2 12.15,28.79 X2.4
P0.15  (via drill 0.2)
  Top 0.2: X2.3 11.55,31.36 IC1.24 10.05,29.85 10.35,29.85 v10.55,29.65 | R7.2 3.2,17.05 T1.1 5.85,19.7 v6.35,19.7
  Bottom 0.2: v10.55,29.65 10.55,22.9 9.9,22.25 9.9,20.2 9.6,19.9 6.55,19.9 v6.35,19.7
P1.0/LED1
  Top 0.2: IC1.14 5.09,28.69
P1.1/LED2
  Top 0.2: IC1.13
P1.2/SWCLK  (via drill 0.2)
  Top 0.2: 4.75,29.91 IC1.12 4.15,29.95 v4,30.1 | R104.2 9.75,34.05 v9.7,34
  Bottom 0.2: v9.7,34 9.7,33.55 7.9,31.75 5.65,31.75 v4,30.1
P1.3/SWD  (via drill 0.2)
  Top 0.2: IC1.11 5.09,30.31 | IC1.11 5.11,30.36 | IC1.11 4.82,30.6 4.3,30.6 v4,30.9 | R103.2 v8.8,34
  Bottom 0.2: v8.8,34 8.8,33.25 7.7,32.15 5.25,32.15 v4,30.9
P2.0
  Top 0.2: IC1.1 | IC1.1 12.1,32.8 12.1,33.88 X2.2 12.95,33.9 13.25,33.6 13.25,28.35 12.35,27.45 R8.2
P2.6
  Top 0.2: 8.17,31.07 IC1.4 8.6,31.46 8.6,32 12.12,35.52 X2.1
P2.7/P2.8  (via drill 0.2)
  Top 0.2: IC1.5 8.2,31.78 8.2,32.7 v7.8,33.1
  Bottom 0.2: X1.P$1 4.02,34.3 6.6,34.3 v7.8,33.1
P2.9  (via drill 0.2)
  Top 0.2: IC1.6 7,32.19 v7,32.8
  Bottom 0.2: X1.2 6,33.9 7,32.9 v7,32.8
P2.10  (via drill 0.2)
  Top 0.2: IC1.7 6.3,32 6.3,32.2 6.2,32.3 v6.2,32.8 | X1.3 1.88,30.27 2.9,29.25 2.9,29.2 3.6,28.5 3.6,21.75 v4.45,20.9 | TLX5012B-EXXXX.1 7.12,1.97 v7.1,1.95
  Bottom 0.2: v6.2,32.8 6.2,32.9 5.6,33.5 4.02,33.5 X1.3 | v7.1,1.95 7.1,6.3 6.35,7.05 6.35,8.54 PH2.4 5.45,9.56 5.45,10.75 6.41,11.71 PH1.4 6.4,12.5 4.6,14.3 4.6,20.1 4.45,20.25 v4.45,20.9
P2.11  (via drill 0.2)
  Top 0.2: IC1.8 6.19,31.41 5.9,31.7 5.9,32 5.4,32.5 5.4,32.7 v5.3,32.8 | X1.4 3,27.7 3,21.4 3.95,20.45 v3.95,20.35 | v6.2,2.5 6.2,2.15 5.95,1.9 4.52,1.9 TLX5012B-EXXXX.8 | IC1.21 8.84,27.3 v9.05,27.3
  Bottom 0.2: 5.4,32.7 v5.3,32.8 4.75,32.8 1.88,29.93 X1.4 1.96,28.9 4.75,28.9 6.35,27.3 v9.05,27.3 | v6.2,2.5 6.2,6.05 4.1,8.15 4.1,8.37 PH2.2 2.75,9.72 2.75,10.65 3.87,11.77 PH1.2 3.85,11.87 3.85,20.25 v3.95,20.35
Q200
  Top 0.2: IC101.29 6.25,37.37 C109.1 6,36.89 5.64,36.53 5.64,34.49 5.35,34.2 Q101.3
RX_XMC4200  (via drill 0.2)
  Top 0.2: v12.3,41.5 12.3,43.5 12.05,43.75 IC101.46 | v9.7,31.2 9.7,31.12 IC1.2
  Bottom 0.2: v12.3,41.5 12.3,40.9 12.6,40.6 12.6,39.9 10.7,38 10.7,32.2 v9.7,31.2
SWCLK  (via drill 0.2)
  Top 0.2: IC101.39 v9.55,40.25 | v2.6,40.25 IC101.22 | R104.1 9.75,36.2 8.8,37.15 v8.8,37.2
  Bottom 0.2: 8.55,39.3 8.2,39.65 6.8,39.65 6.4,40.05 3.95,40.05 3.75,40.25 v2.6,40.25 | 8.55,39.3 8.6,39.3 | 8.8,39.05 v8.8,37.2 | 8.8,39.05 8.55,39.3 | 8.8,39.05 8.8,39.55 9.5,40.25 v9.55,40.25
TX_XMC4200  (via drill 0.2)
  Top 0.2: R102.2 11.53,41.63 v11.4,41.5 | IC1.3 9,31.14 9,31.5 v9.6,32.1
  Bottom 0.2: v11.4,41.5 11.4,41.2 12.2,40.4 12.2,40.1 10.3,38.2 10.3,32.8 v9.6,32.1
USBVCC  (via drill 0.2)
  Top 0.2: X101.1 9.72,50.28 9.9,50.1 11.05,50.1 v11.2,49.95 | v3.3,49.95 3.3,51 D101.A | v5.3,25.95 5.3,24.77 C7.1 5.29,24.46 5.29,23.76 5.55,23.5 6.62,23.5 IC3.3
  Bottom 0.2: v11.2,49.95 v3.3,49.95 11.35,49.95 13.3,48 13.3,33.4 12.5,32.6 11.9,32.6 10,30.7 10,26.8 9.4,26.2 5.55,26.2 v5.3,25.95
VDD_SENS  (via drill 0.2)
  Top 0.2: C3.1 TLX5012B-EXXXX.6 7.21,4.51 7.68,4.98 PH2.5 | 8.8,19.1 T2.2 | T2.2 9.1,19.1 9.6,19.1 9.8,18.9 v9.8,18.8 10.35,18.25 10.35,17.55 10.75,17.15 R2.2 | T2.2 7.6,19.25 7,19.85 IC3.4 6.97,20.5 5.65,20.5 C6.1
  Bottom 0.2: PH2.5 7.7,8.6 8.4,9.3 8.4,11.13 PH1.5 9.55,13.72 9.55,18.55 v9.8,18.8
WUSB_DM
  Top 0.2: R105.1 11,47.6 9.7,46.3 9.1,46.3 8.75,45.95 IC101.3
WUSB_DP
  Top 0.2: IC101.4 8.25,46.1 8.9,46.75 R106.1
WVDDC  (via drill 0.2)
  Top 0.2: 9.5,37.8 7.5,37.8 7.25,38.05 IC101.31 | v7.4,44.4 7.25,44.55 IC101.6 7.25,45.95 7,46.2 C106.1 | 12.55,40.2 C108.1 12.75,40.35 v11.4,40.35 11.4,39.2 10,37.8 9.5,37.8 | C105.1 10,37.3 9.5,37.8
  Bottom 0.2: v7.4,44.4 9,44.4 9.7,43.7 9.7,41.9 arc-45 9.79,41.87 v11.4,40.35

### Text on the board
bPlace: www.infineon.com | Angle Sensor 2Go - V2 | P2.7 | P2.6 | P2.9 | P2.0 | P2.10 | P0.15 | P2.11 | P0.14 | VSS | P0.9 | VDD | P0.8 | P0.0 | P0.7 | P0.5 | P0.6 | IFA | IFB | GND | IFC | VDD | CSQ | SCK | DATA